# Altium project STB_LightBoard.PrjPcb (part 6 of 10)

## Sheet LED_Driver_NF2L757GT-F1.SchDoc: STB Light Board - 3000K
size A3; Author: mayerph; DrawnBy: mayerph; Organization: PBL; Revision: A; SheetNumber: 5; SheetTotal: 20
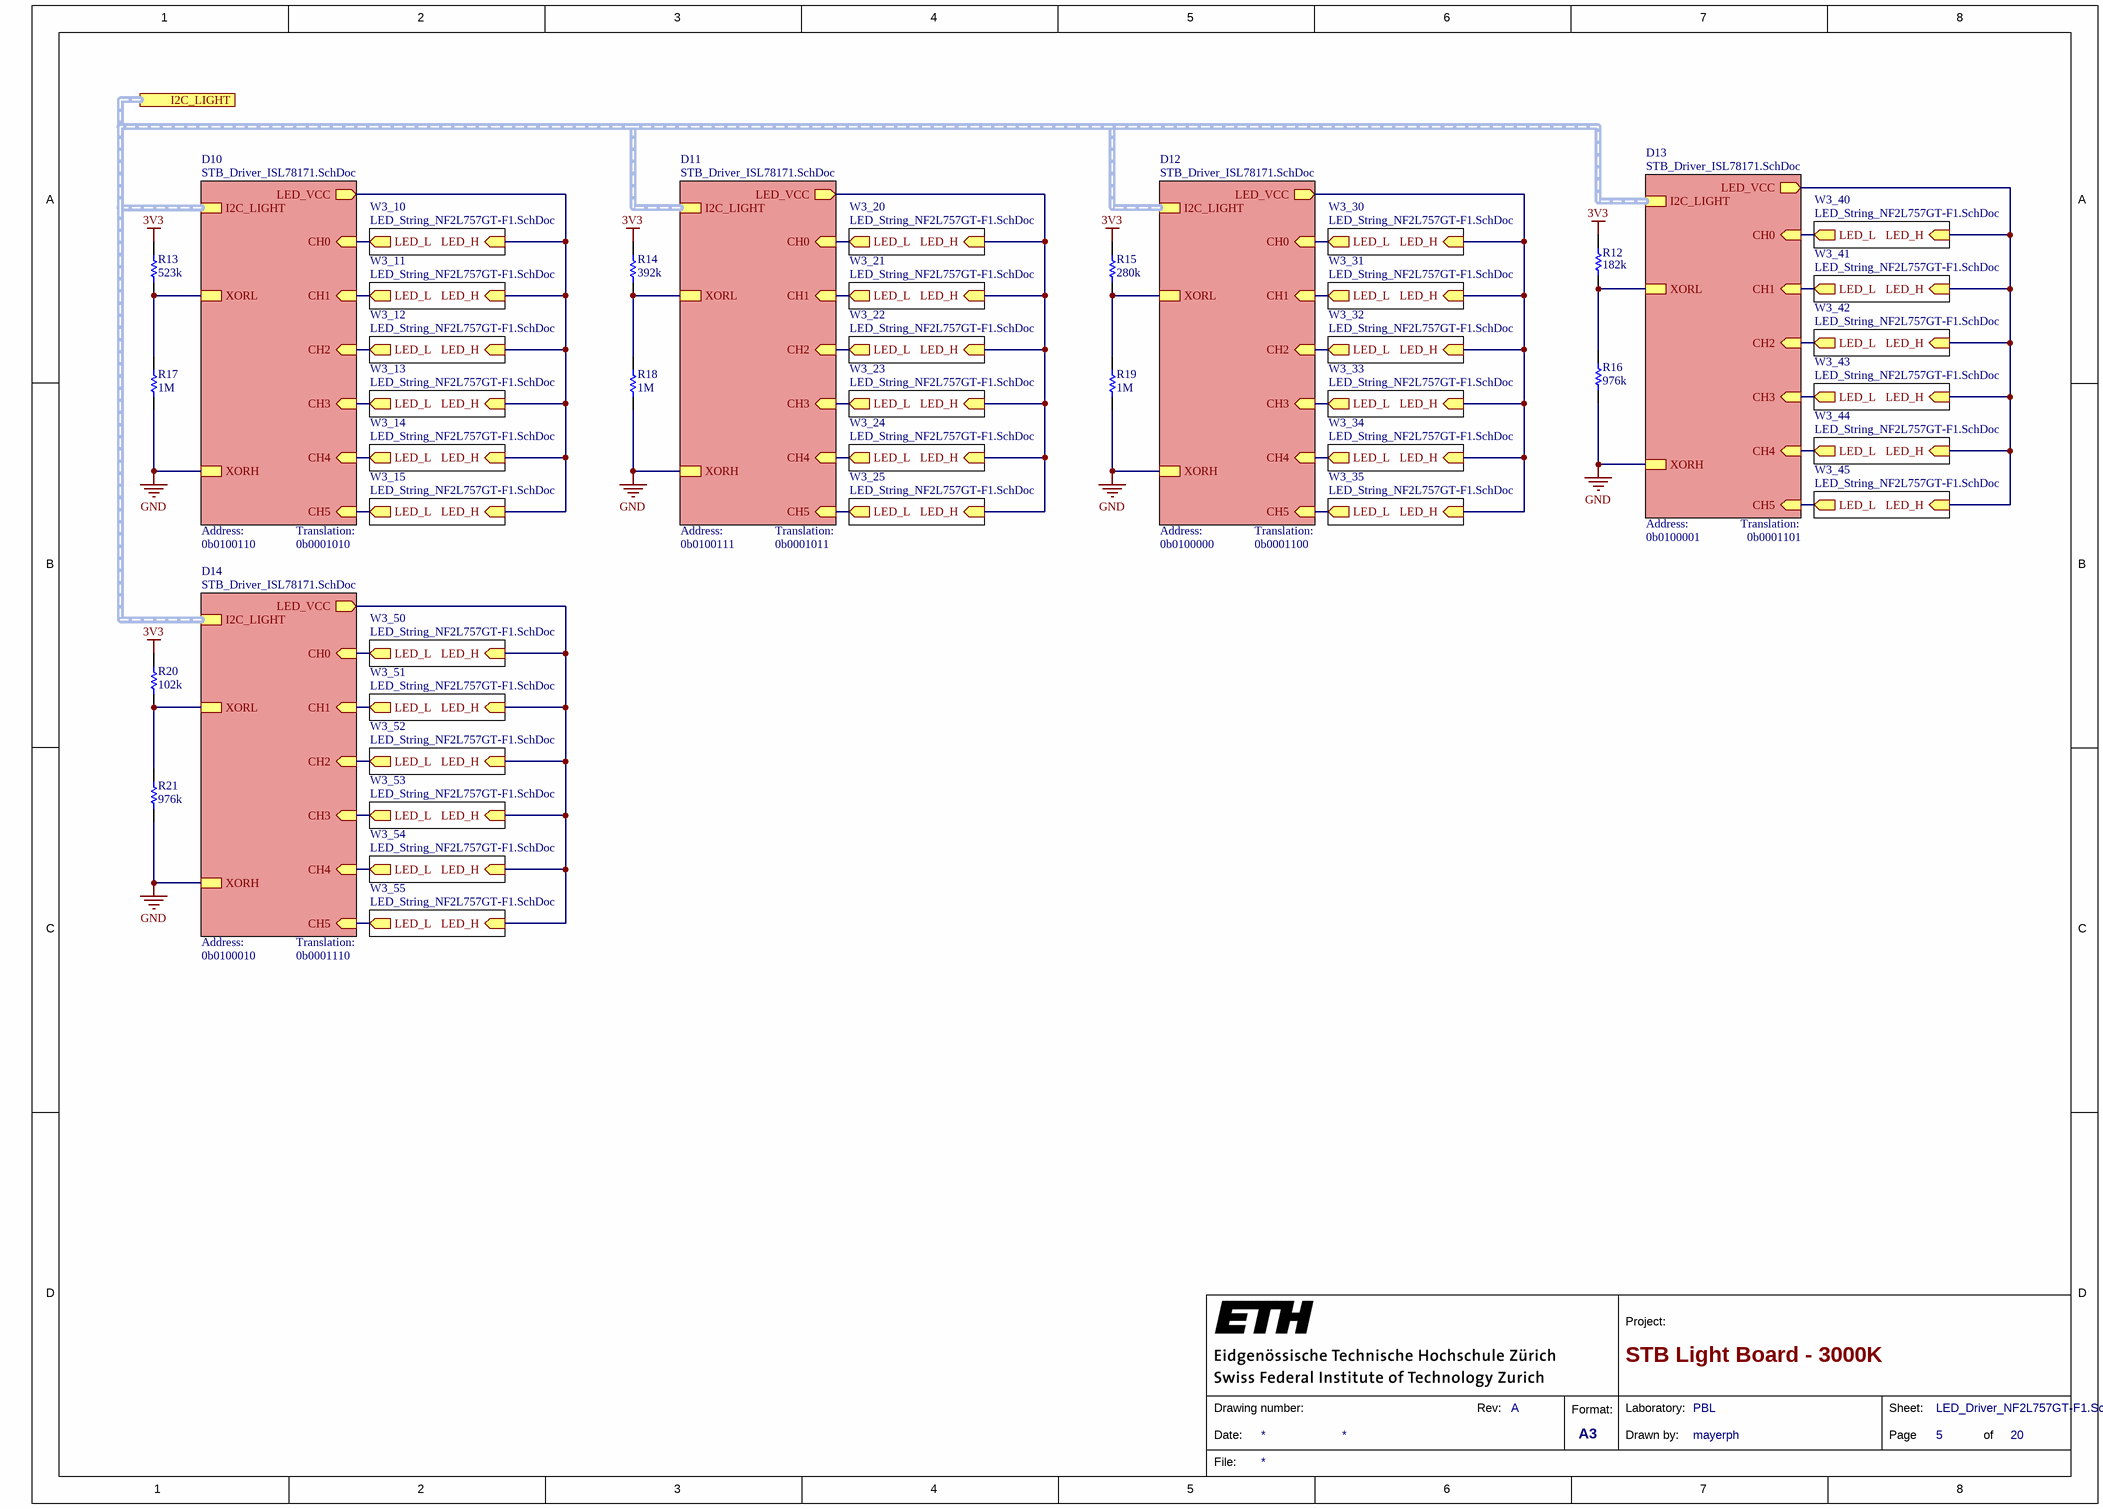
[diagram p12: LED_Driver_NF2L757GT-F1.SchDoc]

### Parts
R12  182k  [RESC1005X40X25LL05T05]
R13  523k  [RESC1005X40X25LL05T05]
R14  392k  [RESC1005X40X25LL05T05]
R15  280k  [RESC1005X40X25LL05T05]
R16  976k  [RESC1005X40X25LL05T05]
R17  1M  [RESC1005X40X25LL05T05]
R18  1M  [RESC1005X40X25LL05T05]
R19  1M  [RESC1005X40X25LL05T05]
R20  102k  [RESC1005X40X25LL05T05]
R21  976k  [RESC1005X40X25LL05T05]

### Sub-sheets
D10 = STB_Driver_ISL78171.SchDoc: CH0 (in), XORL, XORH, LED_VCC (out), CH1 (in), CH2 (in), CH3 (in), CH4 (in), CH5 (in), I2C_LIGHT (harness I2C_LIGHT)
D11 = STB_Driver_ISL78171.SchDoc: CH0 (in), XORL, XORH, LED_VCC (out), CH1 (in), CH2 (in), CH3 (in), CH4 (in), CH5 (in), I2C_LIGHT (harness I2C_LIGHT)
D12 = STB_Driver_ISL78171.SchDoc: CH0 (in), XORL, XORH, LED_VCC (out), CH1 (in), CH2 (in), CH3 (in), CH4 (in), CH5 (in), I2C_LIGHT (harness I2C_LIGHT)
D13 = STB_Driver_ISL78171.SchDoc: CH0 (in), XORL, XORH, LED_VCC (out), CH1 (in), CH2 (in), CH3 (in), CH4 (in), CH5 (in), I2C_LIGHT (harness I2C_LIGHT)
D14 = STB_Driver_ISL78171.SchDoc: CH0 (in), XORL, XORH, LED_VCC (out), CH1 (in), CH2 (in), CH3 (in), CH4 (in), CH5 (in), I2C_LIGHT (harness I2C_LIGHT)
W3_10 = LED_String_NF2L757GT-F1.SchDoc: LED_H (in), LED_L (out)
W3_11 = LED_String_NF2L757GT-F1.SchDoc: LED_H (in), LED_L (out)
W3_12 = LED_String_NF2L757GT-F1.SchDoc: LED_H (in), LED_L (out)
W3_13 = LED_String_NF2L757GT-F1.SchDoc: LED_H (in), LED_L (out)
W3_14 = LED_String_NF2L757GT-F1.SchDoc: LED_H (in), LED_L (out)
W3_15 = LED_String_NF2L757GT-F1.SchDoc: LED_H (in), LED_L (out)
W3_20 = LED_String_NF2L757GT-F1.SchDoc: LED_H (in), LED_L (out)
W3_21 = LED_String_NF2L757GT-F1.SchDoc: LED_H (in), LED_L (out)
W3_22 = LED_String_NF2L757GT-F1.SchDoc: LED_H (in), LED_L (out)
W3_23 = LED_String_NF2L757GT-F1.SchDoc: LED_H (in), LED_L (out)
W3_24 = LED_String_NF2L757GT-F1.SchDoc: LED_H (in), LED_L (out)
W3_25 = LED_String_NF2L757GT-F1.SchDoc: LED_H (in), LED_L (out)
W3_30 = LED_String_NF2L757GT-F1.SchDoc: LED_H (in), LED_L (out)
W3_31 = LED_String_NF2L757GT-F1.SchDoc: LED_H (in), LED_L (out)
W3_32 = LED_String_NF2L757GT-F1.SchDoc: LED_H (in), LED_L (out)
W3_33 = LED_String_NF2L757GT-F1.SchDoc: LED_H (in), LED_L (out)
W3_34 = LED_String_NF2L757GT-F1.SchDoc: LED_H (in), LED_L (out)
W3_35 = LED_String_NF2L757GT-F1.SchDoc: LED_H (in), LED_L (out)
W3_40 = LED_String_NF2L757GT-F1.SchDoc: LED_H (in), LED_L (out)
W3_41 = LED_String_NF2L757GT-F1.SchDoc: LED_H (in), LED_L (out)
W3_42 = LED_String_NF2L757GT-F1.SchDoc: LED_H (in), LED_L (out)
W3_43 = LED_String_NF2L757GT-F1.SchDoc: LED_H (in), LED_L (out)
W3_44 = LED_String_NF2L757GT-F1.SchDoc: LED_H (in), LED_L (out)
W3_45 = LED_String_NF2L757GT-F1.SchDoc: LED_H (in), LED_L (out)
W3_50 = LED_String_NF2L757GT-F1.SchDoc: LED_H (in), LED_L (out)
W3_51 = LED_String_NF2L757GT-F1.SchDoc: LED_H (in), LED_L (out)
W3_52 = LED_String_NF2L757GT-F1.SchDoc: LED_H (in), LED_L (out)
W3_53 = LED_String_NF2L757GT-F1.SchDoc: LED_H (in), LED_L (out)
W3_54 = LED_String_NF2L757GT-F1.SchDoc: LED_H (in), LED_L (out)
W3_55 = LED_String_NF2L757GT-F1.SchDoc: LED_H (in), LED_L (out)

### Ports
I2C_LIGHT (harness I2C_LIGHT, see STB_LightBoard[3C], LED_Driver_AREM-80C0[1A], LED_Driver_AREM-90C0[1A], LED_Driver_NE2B757GT[2B], LED_Driver_NE2G757GT[2B], LED_Driver_NE2R757GT-P6[2B], LED_Driver_NF2W757GT-F1[1A], LED_Driver_QBHP686[1A], STB_Driver_ISL78171[1A], STB_FanControl[1A], STB_UID[1A])

### Nets
3V3: R12.2 R13.2 R14.2 R15.2 R20.2
GND: R16.1 R17.1 R18.1 R19.1 R21.1 ; sheet D10/XORH, sheet D11/XORH, sheet D12/XORH, sheet D13/XORH, sheet D14/XORH
NetC7_D10_2: sheet D10/LED_VCC, sheet W3_10/LED_H, sheet W3_11/LED_H, sheet W3_12/LED_H, sheet W3_13/LED_H, sheet W3_14/LED_H, sheet W3_15/LED_H
NetC7_D11_2: sheet D11/LED_VCC, sheet W3_20/LED_H, sheet W3_21/LED_H, sheet W3_22/LED_H, sheet W3_23/LED_H, sheet W3_24/LED_H, sheet W3_25/LED_H
NetC7_D12_2: sheet D12/LED_VCC, sheet W3_30/LED_H, sheet W3_31/LED_H, sheet W3_32/LED_H, sheet W3_33/LED_H, sheet W3_34/LED_H, sheet W3_35/LED_H
NetC7_D13_2: sheet D13/LED_VCC, sheet W3_40/LED_H, sheet W3_41/LED_H, sheet W3_42/LED_H, sheet W3_43/LED_H, sheet W3_44/LED_H, sheet W3_45/LED_H
NetC7_D14_2: sheet D14/LED_VCC, sheet W3_50/LED_H, sheet W3_51/LED_H, sheet W3_52/LED_H, sheet W3_53/LED_H, sheet W3_54/LED_H, sheet W3_55/LED_H
NetLED103_W3_10_1: sheet D10/CH0, sheet W3_10/LED_L
NetLED103_W3_11_1: sheet D10/CH1, sheet W3_11/LED_L
NetLED103_W3_12_1: sheet D10/CH2, sheet W3_12/LED_L
NetLED103_W3_13_1: sheet D10/CH3, sheet W3_13/LED_L
NetLED103_W3_14_1: sheet D10/CH4, sheet W3_14/LED_L
NetLED103_W3_15_1: sheet D10/CH5, sheet W3_15/LED_L
NetLED103_W3_20_1: sheet D11/CH0, sheet W3_20/LED_L
NetLED103_W3_21_1: sheet D11/CH1, sheet W3_21/LED_L
NetLED103_W3_22_1: sheet D11/CH2, sheet W3_22/LED_L
NetLED103_W3_23_1: sheet D11/CH3, sheet W3_23/LED_L
NetLED103_W3_24_1: sheet D11/CH4, sheet W3_24/LED_L
NetLED103_W3_25_1: sheet D11/CH5, sheet W3_25/LED_L
NetLED103_W3_30_1: sheet D12/CH0, sheet W3_30/LED_L
NetLED103_W3_31_1: sheet D12/CH1, sheet W3_31/LED_L
NetLED103_W3_32_1: sheet D12/CH2, sheet W3_32/LED_L
NetLED103_W3_33_1: sheet D12/CH3, sheet W3_33/LED_L
NetLED103_W3_34_1: sheet D12/CH4, sheet W3_34/LED_L
NetLED103_W3_35_1: sheet D12/CH5, sheet W3_35/LED_L
NetLED103_W3_40_1: sheet D13/CH0, sheet W3_40/LED_L
NetLED103_W3_41_1: sheet D13/CH1, sheet W3_41/LED_L
NetLED103_W3_42_1: sheet D13/CH2, sheet W3_42/LED_L
NetLED103_W3_43_1: sheet D13/CH3, sheet W3_43/LED_L
NetLED103_W3_44_1: sheet D13/CH4, sheet W3_44/LED_L
NetLED103_W3_45_1: sheet D13/CH5, sheet W3_45/LED_L
NetLED103_W3_50_1: sheet D14/CH0, sheet W3_50/LED_L
NetLED103_W3_51_1: sheet D14/CH1, sheet W3_51/LED_L
NetLED103_W3_52_1: sheet D14/CH2, sheet W3_52/LED_L
NetLED103_W3_53_1: sheet D14/CH3, sheet W3_53/LED_L
NetLED103_W3_54_1: sheet D14/CH4, sheet W3_54/LED_L
NetLED103_W3_55_1: sheet D14/CH5, sheet W3_55/LED_L
NetR12_1: R12.1 R16.2 ; sheet D13/XORL
NetR13_1: R13.1 R17.2 ; sheet D10/XORL
NetR14_1: R14.1 R18.2 ; sheet D11/XORL
NetR15_1: R15.1 R19.2 ; sheet D12/XORL
NetR20_1: R20.1 R21.2 ; sheet D14/XORL

### Buses and harness runs
harness port I2C_LIGHT = sheet D10/I2C_LIGHT = sheet D11/I2C_LIGHT = sheet D12/I2C_LIGHT = sheet D13/I2C_LIGHT = sheet D14/I2C_LIGHT

### Notes on the sheet
- 0b0100110
- Address:
- Translation:
- 0b0001010
- 0b0100111
- 0b0001011
- 0b0100000
- 0b0001100
- 0b0100001
- 0b0001101
- 0b0100010
- 0b0001110
- 1
- 2
- 3
- 4
- 5
- 6
- 7
- 8
- A
- B
- C
- D
- Project:
- Date:
- Drawing number:
- Rev:
- Format:
- A3
- Drawn by:
- Laboratory:
- Page
- Sheet:
- of
- File:

### Library data of the parts
R12 = CMP-2002-08256-1: Manufacturer: Vishay Dale; Part Number: CRCW0402182KFKED; Value: 182 kOhm; Tolerance: 1%; Rated Power Dissipation (P): 63mW; Resistance: 182kR; Temperature Coefficient: 100ppm/°C; Working Voltage: 50V; Rated Temperature: 70°C; Package Height: 0.35mm; Package Length: 1mm; Package Width: 0.5mm; Reference Standard: AEC-Q200; Supplier 1: Digi-Key; Supplier Part Number 1: 541-182KLDKR-ND; Manufacturer Part Number: CRCW0402182KFKED; RoHS: Yes; Category: Chip SMD Resistors; Stock 1: 76709; Pricing 1: 1=0.10000, 10=0.03600, 100=0.01460, 1000=0.00656, 2500=0.00569, 5000=0.00470 (USD); Mount: Surface Mount; Number of Pins: 2; Size Code: 0402; Terminal Finish: Nickel; Package Shape: Rectangular; Min Operating Temperature: -55°C; Max Operating Temperature: 155°C; JESD-609 Code: e3; Resistor Type: FIXED RESISTOR; Construction: Chip; Package Style: SMTMeter; Packaging: Tape and Reel; Technology: METAL GLAZE/THICK FILM; Termination: Wraparound; Reach SVHC Compliant: Yes; RoHS Compliant: Yes; ComponentLink1URL: https://datasheet.ciiva.com:443/pdfs/VipMasterIC/IC/VISH/VISH-S-A0007266705/VISH-S-A0007266705-1.pdf?src-supplier=IHS+Markit; ComponentLink1Description: https://datasheet.ciiva.com:443/pdfs/VipMasterIC/IC/VISH/VISH-S-A0007266705/VISH-S-A0007266705-1.pdf?src-supplier=IHS+Markit; ComponentLink2URL: https://datasheet.ciiva.com/3256/dcrcwe3-3256117.pdf?src-supplier=Avnet; ComponentLink2Description: https://datasheet.ciiva.com/3256/dcrcwe3-3256117.pdf?src-supplier=Avnet; ComponentLink3URL: https://datasheet.ciiva.com/2463/dcrcwe3-2463286.pdf?src-supplier=Digi-Key; ComponentLink3Description: https://datasheet.ciiva.com/2463/dcrcwe3-2463286.pdf?src-supplier=Digi-Key; ComponentLink4URL: https://datasheet.ciiva.com/5545/dcrcwe3-109170-5545910.pdf?src-supplier=Mouser; ComponentLink4Description: https://datasheet.ciiva.com/5545/dcrcwe3-109170-5545910.pdf?src-supplier=Mouser; ComponentLink5URL: https://datasheet.ciiva.com/2463/dcrcwe3-2463287.pdf?src-supplier=Digi-Key; ComponentLink5Description: https://datasheet.ciiva.com/2463/dcrcwe3-2463287.pdf?src-supplier=Digi-Key; ComponentLink6URL: https://datasheet.ciiva.com/7714/1697337-7714183.pdf?src-supplier=Element14; ComponentLink6Description: https://datasheet.ciiva.com/7714/1697337-7714183.pdf?src-supplier=Element14; ComponentLink7URL: https://datasheet.ciiva.com/2463/dcrcwe3-2463288.pdf?src-supplier=Digi-Key; ComponentLink7Description: https://datasheet.ciiva.com/2463/dcrcwe3-2463288.pdf?src-supplier=Digi-Key; ComponentLink8URL: https://datasheet.ciiva.com/16785/70201119-16785993.pdf?src-supplier=Allied+Electronics; ComponentLink8Description: https://datasheet.ciiva.com/16785/70201119-16785993.pdf?src-supplier=Allied+Electronics; ComponentLink9URL: https://datasheet.ciiva.com/7714/1697337-7714365.pdf?src-supplier=Element14; ComponentLink9Description: https://datasheet.ciiva.com/7714/1697337-7714365.pdf?src-supplier=Element14
R13 = CMP-2002-00982-1: Manufacturer: Panasonic; Part Number: ERJ-2RKF5233X; Tolerance: 1%; Rated Power Dissipation (P): 100mW; Value: 523 kOhm; Temperature Coefficient: 100ppm/°C; Working Voltage: 50V; Rated Temperature: 70°C; Package Height: 0.35mm; Package Length: 1mm; Package Width: 0.5mm; Reference Standard: AEC-Q200; Supplier 1: Digi-Key; Supplier Part Number 1: P523KLCT-ND; Manufacturer Part Number: ERJ-2RKF5233X; RoHS: Yes; Category: Chip SMD Resistors; Stock 1: 154886; Pricing 1: 1=0.10000, 10=0.03300, 100=0.01330, 1000=0.00599, 2500=0.00520, 5000=0.00429 (USD); Mount: Surface Mount; Number of Pins: 2; Size Code: 0402; Terminal Finish: Nickel; Package Shape: Rectangular; Min Operating Temperature: -55°C; Max Operating Temperature: 155°C; JESD-609 Code: e3; Resistor Type: FIXED RESISTOR; Construction: Rectangular; Package Style: SMTMeter; Packaging: Tape and Reel; Technology: METAL GLAZE/THICK FILM; Termination: Wraparound; Reach SVHC Compliant: Yes; RoHS Compliant: Yes; ComponentLink1URL: https://datasheet.ciiva.com:443/pdfs/VipMasterIC/IC/PANA/PANA-S-A0009889626/PANA-S-A0009889626-1.pdf?src-supplier=IHS+Markit; ComponentLink1Description: https://datasheet.ciiva.com:443/pdfs/VipMasterIC/IC/PANA/PANA-S-A0009889626/PANA-S-A0009889626-1.pdf?src-supplier=IHS+Markit; ComponentLink2URL: https://datasheet.ciiva.com/30220/aoa0000ce2-30220984.pdf?src-supplier=Onlinecomponents.com; ComponentLink2Description: https://datasheet.ciiva.com/30220/aoa0000ce2-30220984.pdf?src-supplier=Onlinecomponents.com; ComponentLink3URL: https://datasheet.ciiva.com/24027/aoa0000ce2-24027141.pdf?src-supplier=Mouser; ComponentLink3Description: https://datasheet.ciiva.com/24027/aoa0000ce2-24027141.pdf?src-supplier=Mouser; ComponentLink4URL: https://datasheet.ciiva.com/9181/aoa0000ce2-9181337.pdf?src-supplier=Avnet; ComponentLink4Description: https://datasheet.ciiva.com/9181/aoa0000ce2-9181337.pdf?src-supplier=Avnet; ComponentLink5URL: https://datasheet.ciiva.com/9181/aoa0000ce2-9181340.pdf?src-supplier=Avnet; ComponentLink5Description: https://datasheet.ciiva.com/9181/aoa0000ce2-9181340.pdf?src-supplier=Avnet; ComponentLink6URL: https://datasheet.ciiva.com/22668/1678782-22668381.pdf?src-supplier=Element14; ComponentLink6Description: https://datasheet.ciiva.com/22668/1678782-22668381.pdf?src-supplier=Element14; ComponentLink7URL: https://datasheet.ciiva.com/43467/1678782-43467550.pdf?src-supplier=Farnell; ComponentLink7Description: https://datasheet.ciiva.com/43467/1678782-43467550.pdf?src-supplier=Farnell; ComponentLink8URL: https://datasheet.ciiva.com/46372/1678782-46372943.pdf?src-supplier=Element14; ComponentLink8Description: https://datasheet.ciiva.com/46372/1678782-46372943.pdf?src-supplier=Element14
R14 = CMP-2002-00914-1: Part Number: ERJ-2RKF3923X; Manufacturer: Panasonic; Tolerance: 1%; Rated Power Dissipation (P): 100mW; Rated Temperature: 70°C; Value: 392 kOhm; Temperature Coefficient: 100ppm/°C; Working Voltage: 50V; Package Height: 0.35mm; Package Length: 1mm; Package Width: 0.5mm; Reference Standard: AEC-Q200; Supplier 1: Digi-Key; Supplier Part Number 1: P392KLDKR-ND; Manufacturer Part Number: ERJ-2RKF3923X; RoHS: Yes; Category: Chip SMD Resistors; Stock 1: 100496; Pricing 1: 1=0.10000, 10=0.03300, 100=0.01330, 1000=0.00599, 2500=0.00520, 5000=0.00429 (USD); Mount: Surface Mount; Number of Pins: 2; Size Code: 0402; Terminal Finish: Nickel; Package Shape: Rectangular; Min Operating Temperature: -55°C; Max Operating Temperature: 155°C; JESD-609 Code: e3; Resistor Type: FIXED RESISTOR; Construction: Rectangular; Package Style: SMTMeter; Packaging: Tape and Reel; Technology: METAL GLAZE/THICK FILM; Termination: Wraparound; Reach SVHC Compliant: Yes; RoHS Compliant: Yes; ComponentLink1URL: https://datasheet.ciiva.com:443/pdfs/VipMasterIC/IC/PANA/PANA-S-A0009889626/PANA-S-A0009889626-1.pdf?src-supplier=IHS+Markit; ComponentLink1Description: https://datasheet.ciiva.com:443/pdfs/VipMasterIC/IC/PANA/PANA-S-A0009889626/PANA-S-A0009889626-1.pdf?src-supplier=IHS+Markit; ComponentLink2URL: https://datasheet.ciiva.com/24069/aoa0000ce2-24069223.pdf?src-supplier=Mouser; ComponentLink2Description: https://datasheet.ciiva.com/24069/aoa0000ce2-24069223.pdf?src-supplier=Mouser; ComponentLink3URL: https://datasheet.ciiva.com/30085/aoa0000ce2-30085781.pdf?src-supplier=Onlinecomponents.com; ComponentLink3Description: https://datasheet.ciiva.com/30085/aoa0000ce2-30085781.pdf?src-supplier=Onlinecomponents.com; ComponentLink4URL: https://datasheet.ciiva.com/16781/70260748-16781463.pdf?src-supplier=Allied+Electronics; ComponentLink4Description: https://datasheet.ciiva.com/16781/70260748-16781463.pdf?src-supplier=Allied+Electronics; ComponentLink5URL: https://datasheet.ciiva.com/22673/1678782-22673356.pdf?src-supplier=Element14; ComponentLink5Description: https://datasheet.ciiva.com/22673/1678782-22673356.pdf?src-supplier=Element14; ComponentLink6URL: https://datasheet.ciiva.com/46399/1678782-46399980.pdf?src-supplier=Element14; ComponentLink6Description: https://datasheet.ciiva.com/46399/1678782-46399980.pdf?src-supplier=Element14; ComponentLink7URL: https://datasheet.ciiva.com/46399/1678782-46399981.pdf?src-supplier=Element14; ComponentLink7Description: https://datasheet.ciiva.com/46399/1678782-46399981.pdf?src-supplier=Element14; ComponentLink8URL: https://datasheet.ciiva.com/22776/1678782-22776542.pdf?src-supplier=Farnell; ComponentLink8Description: https://datasheet.ciiva.com/22776/1678782-22776542.pdf?src-supplier=Farnell; ComponentLink9URL: https://datasheet.ciiva.com/16774/70260748-16774815.pdf?src-supplier=Allied+Electronics; ComponentLink9Description: https://datasheet.ciiva.com/16774/70260748-16774815.pdf?src-supplier=Allied+Electronics
R15 = CMP-1011-00785-4: Chip Resistor, 280 KOhm, +/- 1%, 100 mW, -55 to 155 degC, 0402 (1005 Metric), RoHS, Cut Tape; PartNumber: ERJ-2RKF2803X; Manufacturer: Basic Passives; Power Rating: 100 mW; Case\/Package: 0402; Voltage Rating: 50 V; Rated Power Dissipation (P): 100mW; Rated Temperature: 70°C; Temperature Coefficient: 100ppm/°C; Working Voltage: 50V; Package Height: 0.35mm; Package Length: 1mm; Package Width: 0.5mm; Reference Standard: AEC-Q200; Value: 280 kOhm; Width: 0.02 inch; Packaging: Cut Tape; Min Operating Temperature: -55 degC; Package Quantity: 10000; Height: 0.016 inch; ComponentLink2Description: Datasheet; REACH SVHC: Yes; Length: 0.039 inch; Mounting Technology: Surface Mount; Mount: Surface Mount; ComponentLink1Description: Manufacturer URL; PackageDescription: 2-Pin Surface Mount Device, Body 1 x 0.5 mm; PackageReference: 0402; Case Code (Metric): 1005; ComponentLink2URL: http://industrial.panasonic.com/cdbs/www-data/pdf/RDA0000/AOA0000C86.pdf; Pins: 2; DatasheetVersion: 04/2015; ComponentLink1URL: http://www.panasonic.com/; RoHSCompliant: true; Case Code (Imperial): 0402; Tolerance: 1%; Max Operating Temperature: 155 degC; Supplier 1: Digi-Key; Supplier Part Number 1: P280KLDKR-ND; Manufacturer Part Number: ERJ-2RKF2803X; RoHS: Yes; Category: Chip SMD Resistors; Stock 1: 156859; Pricing 1: 1=0.10000, 10=0.03300, 100=0.01330, 1000=0.00599, 2500=0.00520, 5000=0.00429 (USD); Number of Pins: 2; Size Code: 0402; Terminal Finish: Nickel; Package Shape: Rectangular; Resistor Type: FIXED RESISTOR; Termination: Wraparound; JESD-609 Code: e3; Construction: Rectangular; Package Style: SMTMeter; Technology: METAL GLAZE/THICK FILM; Reach SVHC Compliant: Yes; RoHS Compliant: Yes; ComponentLink3URL: https://datasheet.ciiva.com:443/pdfs/VipMasterIC/IC/PANA/PANA-S-A0009889626/PANA-S-A0009889626-1.pdf?src-supplier=IHS+Markit; ComponentLink3Description: https://datasheet.ciiva.com:443/pdfs/VipMasterIC/IC/PANA/PANA-S-A0009889626/PANA-S-A0009889626-1.pdf?src-supplier=IHS+Markit; ComponentLink4URL: https://datasheet.ciiva.com/9183/aoa0000ce2-9183500.pdf?src-supplier=Avnet; ComponentLink4Description: https://datasheet.ciiva.com/9183/aoa0000ce2-9183500.pdf?src-supplier=Avnet; ComponentLink5URL: https://datasheet.ciiva.com/28594/1694929-28594570.pdf?src-supplier=Element14; ComponentLink5Description: https://datasheet.ciiva.com/28594/1694929-28594570.pdf?src-supplier=Element14; ComponentLink6URL: https://datasheet.ciiva.com/24024/aoa0000ce2-24024731.pdf?src-supplier=Mouser; ComponentLink6Description: https://datasheet.ciiva.com/24024/aoa0000ce2-24024731.pdf?src-supplier=Mouser; ComponentLink7URL: https://datasheet.ciiva.com/30177/aoa0000ce2-30177532.pdf?src-supplier=Onlinecomponents.com; ComponentLink7Description: https://datasheet.ciiva.com/30177/aoa0000ce2-30177532.pdf?src-supplier=Onlinecomponents.com; ComponentLink8URL: https://datasheet.ciiva.com/7712/1678782-7712815.pdf?src-supplier=Element14; ComponentLink8Description: https://datasheet.ciiva.com/7712/1678782-7712815.pdf?src-supplier=Element14
R16 R21 = CMP-2002-01120-1: Manufacturer: Panasonic; Part Number: ERJ-2RKF9763X; Tolerance: 1%; Rated Power Dissipation (P): 100mW; Rated Temperature: 70°C; Value: 976 kOhm; Temperature Coefficient: 100ppm/°C; Working Voltage: 50V; Package Height: 0.35mm; Package Length: 1mm; Package Width: 0.5mm; Reference Standard: AEC-Q200; Supplier 1: Digi-Key; Supplier Part Number 1: P976KLCT-ND; Manufacturer Part Number: ERJ-2RKF9763X; RoHS: Yes; Category: Chip SMD Resistors; Stock 1: 136638; Pricing 1: 1=0.10000, 10=0.03300, 100=0.01330, 1000=0.00599, 2500=0.00520, 5000=0.00429 (USD); Mount: Surface Mount; Number of Pins: 2; Size Code: 0402; Terminal Finish: Nickel; Package Shape: Rectangular; Min Operating Temperature: -55°C; Max Operating Temperature: 155°C; Resistor Type: FIXED RESISTOR; Construction: Rectangular; Package Style: SMTMeter; Packaging: Tape and Reel; Termination: Wraparound; JESD-609 Code: e3; Technology: METAL GLAZE/THICK FILM; Reach SVHC Compliant: Yes; RoHS Compliant: Yes; ComponentLink1URL: https://datasheet.ciiva.com:443/pdfs/VipMasterIC/IC/PANA/PANA-S-A0009889626/PANA-S-A0009889626-1.pdf?src-supplier=IHS+Markit; ComponentLink1Description: https://datasheet.ciiva.com:443/pdfs/VipMasterIC/IC/PANA/PANA-S-A0009889626/PANA-S-A0009889626-1.pdf?src-supplier=IHS+Markit; ComponentLink2URL: https://datasheet.ciiva.com/43467/1678782-43467581.pdf?src-supplier=Farnell; ComponentLink2Description: https://datasheet.ciiva.com/43467/1678782-43467581.pdf?src-supplier=Farnell; ComponentLink3URL: https://datasheet.ciiva.com/46372/1678782-46372911.pdf?src-supplier=Element14; ComponentLink3Description: https://datasheet.ciiva.com/46372/1678782-46372911.pdf?src-supplier=Element14; ComponentLink4URL: https://datasheet.ciiva.com/22668/1678782-22668415.pdf?src-supplier=Element14; ComponentLink4Description: https://datasheet.ciiva.com/22668/1678782-22668415.pdf?src-supplier=Element14; ComponentLink5URL: https://datasheet.ciiva.com/16758/70260748-16758903.pdf?src-supplier=Allied+Electronics; ComponentLink5Description: https://datasheet.ciiva.com/16758/70260748-16758903.pdf?src-supplier=Allied+Electronics; ComponentLink6URL: https://datasheet.ciiva.com/9179/aoa0000ce2-9179357.pdf?src-supplier=Avnet; ComponentLink6Description: https://datasheet.ciiva.com/9179/aoa0000ce2-9179357.pdf?src-supplier=Avnet; ComponentLink7URL: https://datasheet.ciiva.com/30176/aoa0000ce2-30176831.pdf?src-supplier=Onlinecomponents.com; ComponentLink7Description: https://datasheet.ciiva.com/30176/aoa0000ce2-30176831.pdf?src-supplier=Onlinecomponents.com
R17-R19 = CMP-2002-00609-3: Chip Resistor, 1 MOhm, +/- 1%, 100 mW, -55 to 155 degC, 0402 (1005 Metric), RoHS, Tape and Reel; PartNumber: ERJ-2RKF1004X; Manufacturer: Basic Passives; Voltage Rating: 50 V; Case\/Package: 0402; Value: 1 MOhm; Power Rating: 100 mW; Rated Power Dissipation (P): 100mW; Temperature Coefficient: 100ppm/°C; Working Voltage: 50V; Rated Temperature: 70°C; Package Height: 0.35mm; Package Length: 1mm; Package Width: 0.5mm; Reference Standard: AEC-Q200; Pins: 2; Max Operating Temperature: 155 degC; ComponentLink2URL: http://industrial.panasonic.com/cdbs/www-data/pdf/RDA0000/AOA0000C86.pdf; Weight: 2.8E-05oz; ComponentLink1URL: http://www.panasonic.com/; Radiation Hardening: No; Height: 0.35 mm; Case Code (Imperial): 0402; ComponentLink2Description: Datasheet; Mount: Surface Mount; ComponentLink1Description: Manufacturer URL; REACH SVHC: Yes; Length: 1 mm; Min Operating Temperature: -55 degC; Width: 0.5 mm; Package Quantity: 10000; Tolerance: 1%; PackageDescription: 2-Pin Surface Mount Device, Body 1 x 0.5 mm; RoHSCompliant: true; DatasheetVersion: 04/2015; PackageReference: 0402; Mounting Technology: Surface Mount; Case Code (Metric): 1005; Packaging: Tape and Reel; Supplier 1: Digi-Key; Supplier Part Number 1: P1.00MLDKR-ND; Manufacturer Part Number: ERJ-2RKF1004X; RoHS: Yes; Category: Chip SMD Resistors; Stock 1: 1012879; Pricing 1: 1=0.10000, 10=0.03300, 100=0.01330, 1000=0.00599, 2500=0.00520, 5000=0.00429 (USD); Number of Pins: 2; Package Shape: Rectangular; Size Code: 0402; Terminal Finish: Nickel; JESD-609 Code: e3; Resistor Type: FIXED RESISTOR; Construction: Rectangular; Package Style: SMTMeter; Technology: METAL GLAZE/THICK FILM; Termination: Wraparound; Reach SVHC Compliant: Yes; RoHS Compliant: Yes; ComponentLink3URL: https://datasheet.ciiva.com:443/pdfs/VipMasterIC/IC/PANA/PANA-S-A0009889626/PANA-S-A0009889626-1.pdf?src-supplier=IHS+Markit; ComponentLink3Description: https://datasheet.ciiva.com:443/pdfs/VipMasterIC/IC/PANA/PANA-S-A0009889626/PANA-S-A0009889626-1.pdf?src-supplier=IHS+Markit; ComponentLink4URL: https://datasheet.ciiva.com/34303/1987046-34303551.pdf?src-supplier=Jameco; ComponentLink4Description: https://datasheet.ciiva.com/34303/1987046-34303551.pdf?src-supplier=Jameco; ComponentLink5URL: https://datasheet.ciiva.com/11821/0900766b80f80784-11821229.pdf?src-supplier=RSComponents; ComponentLink5Description: https://datasheet.ciiva.com/11821/0900766b80f80784-11821229.pdf?src-supplier=RSComponents; ComponentLink6URL: https://datasheet.ciiva.com/7909/aoa0000ce2-7909180.pdf?src-supplier=Element14; ComponentLink6Description: https://datasheet.ciiva.com/7909/aoa0000ce2-7909180.pdf?src-supplier=Element14; ComponentLink7URL: https://datasheet.ciiva.com/22723/1678782-22723164.pdf?src-supplier=Element14; ComponentLink7Description: https://datasheet.ciiva.com/22723/1678782-22723164.pdf?src-supplier=Element14; ComponentLink8URL: https://datasheet.ciiva.com/24158/aoa0000ce2-24158990.pdf?src-supplier=Mouser; ComponentLink8Description: https://datasheet.ciiva.com/24158/aoa0000ce2-24158990.pdf?src-supplier=Mouser; ComponentLink9URL: https://datasheet.ciiva.com/16766/70260748-16766711.pdf?src-supplier=Allied+Electronics; ComponentLink9Description: https://datasheet.ciiva.com/16766/70260748-16766711.pdf?src-supplier=Allied+Electronics; ComponentLink10URL: https://datasheet.ciiva.com/16779/70260748-16779288.pdf?src-supplier=Allied+Electronics; ComponentLink10Description: https://datasheet.ciiva.com/16779/70260748-16779288.pdf?src-supplier=Allied+Electronics; ComponentLink11URL: https://datasheet.ciiva.com/16199/aoa0000ce2-16199544.pdf?src-supplier=Future+Electronics; ComponentLink11Description: https://datasheet.ciiva.com/16199/aoa0000ce2-16199544.pdf?src-supplier=Future+Electronics
R20 = CMP-2002-00613-1: Manufacturer: Panasonic; Part Number: ERJ-2RKF1023X; Tolerance: 1%; Rated Power Dissipation (P): 100mW; Rated Temperature: 70°C; Value: 102 kOhm; Temperature Coefficient: 100ppm/°C; Working Voltage: 50V; Package Height: 0.35mm; Package Length: 1mm; Package Width: 0.5mm; Reference Standard: AEC-Q200; Supplier 1: Digi-Key; Supplier Part Number 1: P102KLDKR-ND; Manufacturer Part Number: ERJ-2RKF1023X; RoHS: Yes; Category: Chip SMD Resistors; Stock 1: 79400; Pricing 1: 1=0.10000, 10=0.03300, 100=0.01330, 1000=0.00599, 2500=0.00520, 5000=0.00429 (USD); Mount: Surface Mount; Number of Pins: 2; Size Code: 0402; Terminal Finish: Nickel; Package Shape: Rectangular; Min Operating Temperature: -55°C; Max Operating Temperature: 155°C; Resistor Type: FIXED RESISTOR; Construction: Rectangular; Package Style: SMTMeter; Packaging: Tape and Reel; Technology: METAL GLAZE/THICK FILM; Termination: Wraparound; JESD-609 Code: e3; Reach SVHC Compliant: Yes; RoHS Compliant: Yes; ComponentLink1URL: https://datasheet.ciiva.com:443/pdfs/VipMasterIC/IC/PANA/PANA-S-A0009889626/PANA-S-A0009889626-1.pdf?src-supplier=IHS+Markit; ComponentLink1Description: https://datasheet.ciiva.com:443/pdfs/VipMasterIC/IC/PANA/PANA-S-A0009889626/PANA-S-A0009889626-1.pdf?src-supplier=IHS+Markit; ComponentLink2URL: https://datasheet.ciiva.com/43467/1678782-43467481.pdf?src-supplier=Farnell; ComponentLink2Description: https://datasheet.ciiva.com/43467/1678782-43467481.pdf?src-supplier=Farnell; ComponentLink3URL: https://datasheet.ciiva.com/9119/aoa0000ce2-9119242.pdf?src-supplier=Avnet; ComponentLink3Description: https://datasheet.ciiva.com/9119/aoa0000ce2-9119242.pdf?src-supplier=Avnet; ComponentLink4URL: https://datasheet.ciiva.com/16781/70260748-16781503.pdf?src-supplier=Allied+Electronics; ComponentLink4Description: https://datasheet.ciiva.com/16781/70260748-16781503.pdf?src-supplier=Allied+Electronics; ComponentLink5URL: https://datasheet.ciiva.com/22673/1678782-22673487.pdf?src-supplier=Element14; ComponentLink5Description: https://datasheet.ciiva.com/22673/1678782-22673487.pdf?src-supplier=Element14; ComponentLink6URL: https://datasheet.ciiva.com/16763/70260748-16763080.pdf?src-supplier=Allied+Electronics; ComponentLink6Description: https://datasheet.ciiva.com/16763/70260748-16763080.pdf?src-supplier=Allied+Electronics; ComponentLink7URL: https://datasheet.ciiva.com/7712/1678782-7712798.pdf?src-supplier=Element14; ComponentLink7Description: https://datasheet.ciiva.com/7712/1678782-7712798.pdf?src-supplier=Element14; ComponentLink8URL: https://datasheet.ciiva.com/46373/1678782-46373215.pdf?src-supplier=Element14; ComponentLink8Description: https://datasheet.ciiva.com/46373/1678782-46373215.pdf?src-supplier=Element14

## Sheet LED_String_NF2L757GT-F1.SchDoc: STB Light Board - 3000K String
size A4; Author: flmoll; DrawnBy: flmoll; Organization: PBL; Revision: A; SheetNumber: 6; SheetTotal: 20
Used 30 times, as channels LW2/W3_10, LW2/W3_11, LW2/W3_12, LW2/W3_13, LW2/W3_14, LW2/W3_15, LW2/W3_20, LW2/W3_21, LW2/W3_22, LW2/W3_23, LW2/W3_24, LW2/W3_25, LW2/W3_30, LW2/W3_31, LW2/W3_32, LW2/W3_33, LW2/W3_34, LW2/W3_35, LW2/W3_40, LW2/W3_41, LW2/W3_42, LW2/W3_43, LW2/W3_44, LW2/W3_45, LW2/W3_50, LW2/W3_51, LW2/W3_52, LW2/W3_53, LW2/W3_54, LW2/W3_55. Parts and nets are listed once, with the designators drawn on the sheet.
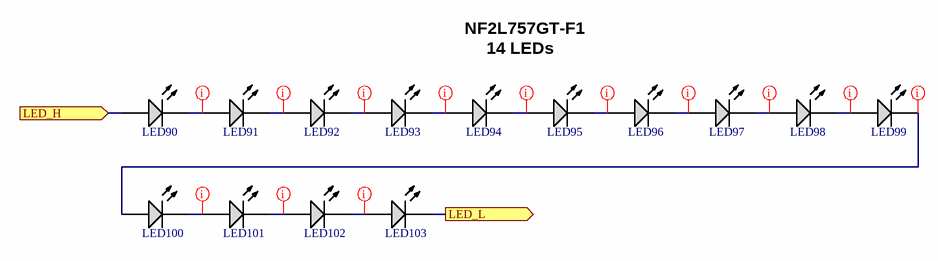
[diagram p13: LED_String_NF2L757GT-F1.SchDoc]

### Parts
LED90  NF2L757GT-F1  [NF2W757GT-F1]  (value not drawn)
LED91  NF2L757GT-F1  [NF2W757GT-F1]  (value not drawn)
LED92  NF2L757GT-F1  [NF2W757GT-F1]  (value not drawn)
LED93  NF2L757GT-F1  [NF2W757GT-F1]  (value not drawn)
LED94  NF2L757GT-F1  [NF2W757GT-F1]  (value not drawn)
LED95  NF2L757GT-F1  [NF2W757GT-F1]  (value not drawn)
LED96  NF2L757GT-F1  [NF2W757GT-F1]  (value not drawn)
LED97  NF2L757GT-F1  [NF2W757GT-F1]  (value not drawn)
LED98  NF2L757GT-F1  [NF2W757GT-F1]  (value not drawn)
LED99  NF2L757GT-F1  [NF2W757GT-F1]  (value not drawn)
LED100  NF2L757GT-F1  [NF2W757GT-F1]  (value not drawn)
LED101  NF2L757GT-F1  [NF2W757GT-F1]  (value not drawn)
LED102  NF2L757GT-F1  [NF2W757GT-F1]  (value not drawn)
LED103  NF2L757GT-F1  [NF2W757GT-F1]  (value not drawn)

### Ports
LED_H (in, see LED_Driver_NF2L757GT-F1[2A]), LED_L (out, see LED_Driver_NF2L757GT-F1[2A])

### Nets
LED_H: LED90.2(A) ; port LED_H
LED_L: LED103.1(K) ; port LED_L
NetLED90_1: LED90.1(K) LED91.2(A)
NetLED91_1: LED91.1(K) LED92.2(A)
NetLED92_1: LED92.1(K) LED93.2(A)
NetLED93_1: LED93.1(K) LED94.2(A)
NetLED94_1: LED94.1(K) LED95.2(A)
NetLED95_1: LED95.1(K) LED96.2(A)
NetLED96_1: LED96.1(K) LED97.2(A)
NetLED97_1: LED97.1(K) LED98.2(A)
NetLED98_1: LED98.1(K) LED99.2(A)
NetLED99_1: LED99.1(K) LED100.2(A)
NetLED100_1: LED100.1(K) LED101.2(A)
NetLED101_1: LED101.1(K) LED102.2(A)
NetLED102_1: LED102.1(K) LED103.2(A)

### Channels
LW2/W3_10: designators end in _W3_10; ports LED_H=NetC7_D10_2 LED_L=NetLED103_W3_10_1
LW2/W3_11: designators end in _W3_11; ports LED_H=NetC7_D10_2 LED_L=NetLED103_W3_11_1
LW2/W3_12: designators end in _W3_12; ports LED_H=NetC7_D10_2 LED_L=NetLED103_W3_12_1
LW2/W3_13: designators end in _W3_13; ports LED_H=NetC7_D10_2 LED_L=NetLED103_W3_13_1
LW2/W3_14: designators end in _W3_14; ports LED_H=NetC7_D10_2 LED_L=NetLED103_W3_14_1
LW2/W3_15: designators end in _W3_15; ports LED_H=NetC7_D10_2 LED_L=NetLED103_W3_15_1
LW2/W3_20: designators end in _W3_20; ports LED_H=NetC7_D11_2 LED_L=NetLED103_W3_20_1
LW2/W3_21: designators end in _W3_21; ports LED_H=NetC7_D11_2 LED_L=NetLED103_W3_21_1
LW2/W3_22: designators end in _W3_22; ports LED_H=NetC7_D11_2 LED_L=NetLED103_W3_22_1
LW2/W3_23: designators end in _W3_23; ports LED_H=NetC7_D11_2 LED_L=NetLED103_W3_23_1
LW2/W3_24: designators end in _W3_24; ports LED_H=NetC7_D11_2 LED_L=NetLED103_W3_24_1
LW2/W3_25: designators end in _W3_25; ports LED_H=NetC7_D11_2 LED_L=NetLED103_W3_25_1
LW2/W3_30: designators end in _W3_30; ports LED_H=NetC7_D12_2 LED_L=NetLED103_W3_30_1
LW2/W3_31: designators end in _W3_31; ports LED_H=NetC7_D12_2 LED_L=NetLED103_W3_31_1
LW2/W3_32: designators end in _W3_32; ports LED_H=NetC7_D12_2 LED_L=NetLED103_W3_32_1
LW2/W3_33: designators end in _W3_33; ports LED_H=NetC7_D12_2 LED_L=NetLED103_W3_33_1
LW2/W3_34: designators end in _W3_34; ports LED_H=NetC7_D12_2 LED_L=NetLED103_W3_34_1
LW2/W3_35: designators end in _W3_35; ports LED_H=NetC7_D12_2 LED_L=NetLED103_W3_35_1
LW2/W3_40: designators end in _W3_40; ports LED_H=NetC7_D13_2 LED_L=NetLED103_W3_40_1
LW2/W3_41: designators end in _W3_41; ports LED_H=NetC7_D13_2 LED_L=NetLED103_W3_41_1
LW2/W3_42: designators end in _W3_42; ports LED_H=NetC7_D13_2 LED_L=NetLED103_W3_42_1
LW2/W3_43: designators end in _W3_43; ports LED_H=NetC7_D13_2 LED_L=NetLED103_W3_43_1
LW2/W3_44: designators end in _W3_44; ports LED_H=NetC7_D13_2 LED_L=NetLED103_W3_44_1
LW2/W3_45: designators end in _W3_45; ports LED_H=NetC7_D13_2 LED_L=NetLED103_W3_45_1
LW2/W3_50: designators end in _W3_50; ports LED_H=NetC7_D14_2 LED_L=NetLED103_W3_50_1
LW2/W3_51: designators end in _W3_51; ports LED_H=NetC7_D14_2 LED_L=NetLED103_W3_51_1
LW2/W3_52: designators end in _W3_52; ports LED_H=NetC7_D14_2 LED_L=NetLED103_W3_52_1
LW2/W3_53: designators end in _W3_53; ports LED_H=NetC7_D14_2 LED_L=NetLED103_W3_53_1
LW2/W3_54: designators end in _W3_54; ports LED_H=NetC7_D14_2 LED_L=NetLED103_W3_54_1
LW2/W3_55: designators end in _W3_55; ports LED_H=NetC7_D14_2 LED_L=NetLED103_W3_55_1

### Layout directives
net class LED: NetLED90_W3_10_1, NetLED91_W3_10_1, NetLED92_W3_10_1, NetLED93_W3_10_1, NetLED94_W3_10_1, NetLED95_W3_10_1, NetLED96_W3_10_1, NetLED97_W3_10_1, NetLED98_W3_10_1, NetLED99_W3_10_1, NetLED100_W3_10_1, NetLED101_W3_10_1, NetLED102_W3_10_1

### Notes on the sheet
- NF2L757GT-F1
- 14 LEDs
- 1
- 2
- 3
- 4
- A
- B
- C
- Project:
- D
- Date:
- Drawing number:
- Rev:
- Format:
- A4 Q
- Drawn by:
- Laboratory:
- Page
- Sheet:
- of
- File:

### Library data of the parts
LED90-LED103 = CMP-02059-1: SMD LED White 2,76 V, 31,2 lm 3030 (1212); Manufacturer: Nichia; Manufacturer Part Number: NF2L757GT-F1 Optisolis; Optoelectronic Device Type: SINGLE COLOR LED; Vf: 2.76 V; Intensity: 31.2 lm; REACH SVHC: No SVHC; RoHS Compliant: Yes; Color: White